# EAGLE schematic fabwalker-0930-2 (EAGLE 7.4.0)
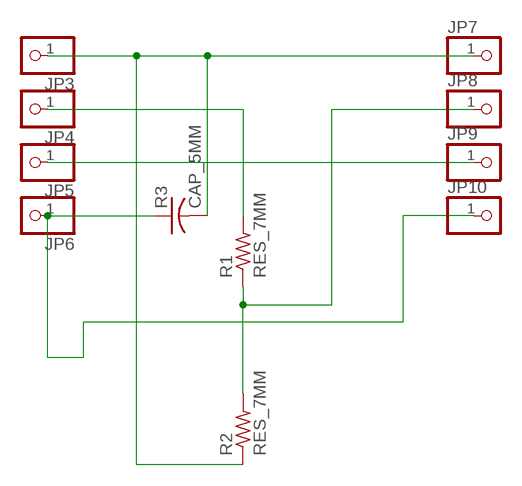
[diagram p0: schematic, sheet 1]

## Parts
JP3  PINHD-1X1  [1X01]
JP4  PINHD-1X1  [1X01]
JP5  PINHD-1X1  [1X01]
JP6  PINHD-1X1  [1X01]
JP7  PINHD-1X1  [1X01]
JP8  PINHD-1X1  [1X01]
JP9  PINHD-1X1  [1X01]
JP10  PINHD-1X1  [1X01]
R1  RES_7MM  [0204/7]
R2  RES_7MM  [0204/7]
R3  CAP_5MM  [C050-030X075]

## Nets
N$1: JP3.1 JP7.1 R2.1 R3.2
N$2: JP4.1 R1.2
N$3: JP8.1 R1.1 R2.2
N$4: JP6.1 JP10.1 R3.1
N$6: JP5.1 JP9.1

## Library data of the parts
JP3-JP10 = Yamaguchi:PINHD-1X1: PIN HEADER
R1 R2 = Yamaguchi:RES_7MM
R3 = Yamaguchi:CAP_5MM